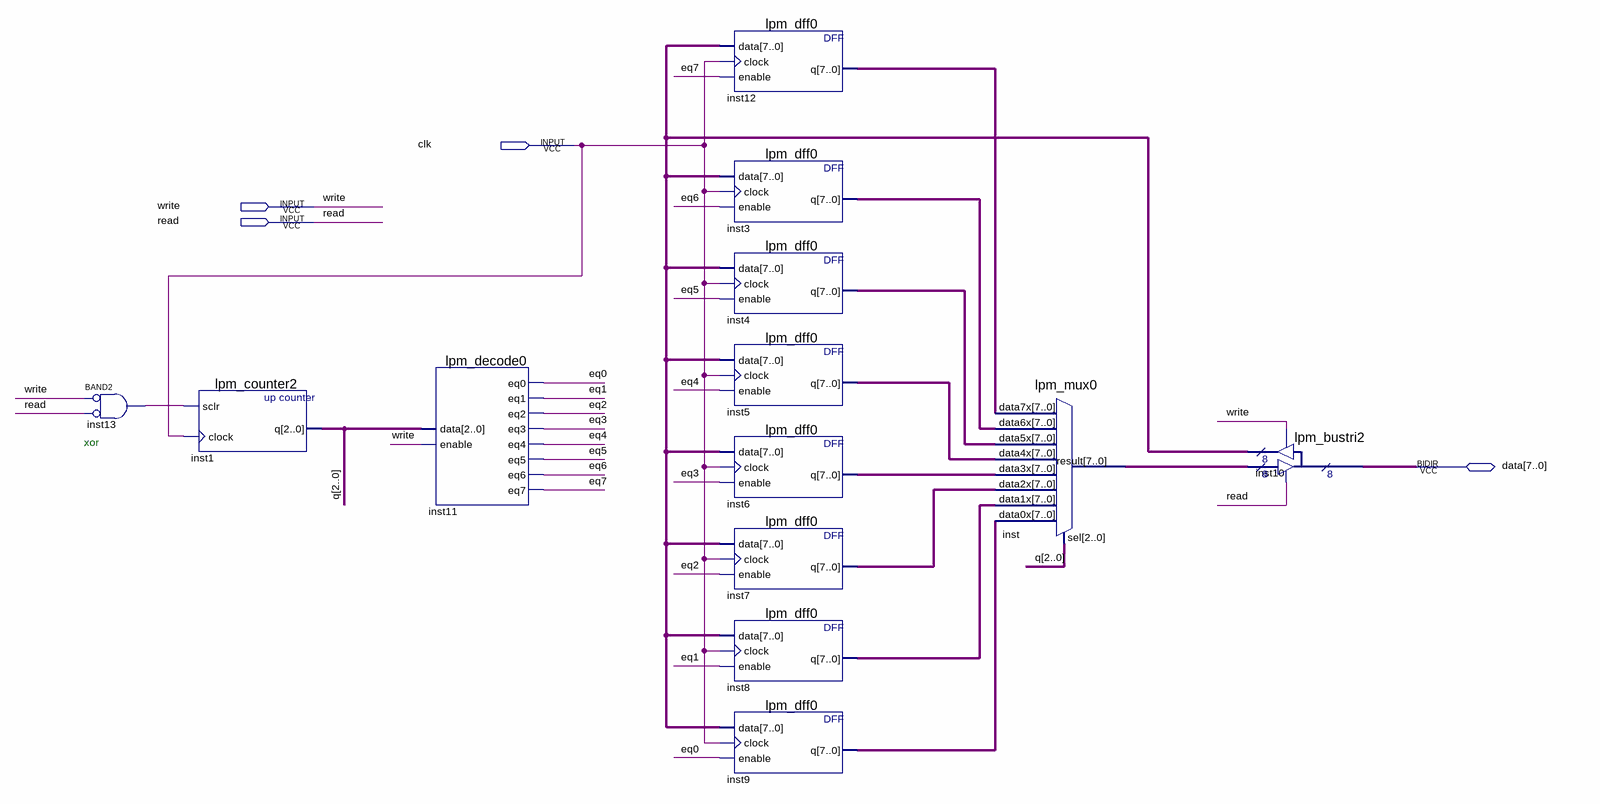
[diagram p0: schematic sheet]
// Quartus schematic Buffer.bdf as structural Verilog: 13 symbols, 4 pins
module Buffer (
  input  clk,
  input  write,
  input  read,
  inout  [7:0] data
);

  wire eq0, eq1, eq2, eq3, eq4, eq5, eq6, eq7, inst13_out;
  wire [2:0] q;
  wire [7:0] inst3_q, inst4_q, inst5_q, inst6_q, inst7_q, inst8_q, inst9_q, inst10_result, inst12_q,
       inst_result;

  and inst13 (inst13_out, ~write, ~read);  // BAND2
  lpm_counter2 inst1 (.sclr(inst13_out), .clock(clk), .q(q));
  lpm_decode0 inst11 (
    .data(q), .enable(write), .eq0(eq0), .eq1(eq1), .eq2(eq2), .eq3(eq3), .eq4(eq4), .eq5(eq5), .eq6(eq6),
    .eq7(eq7));
  lpm_dff0 inst12 (.data(inst10_result), .clock(clk), .enable(eq7), .q(inst12_q));
  lpm_dff0 inst3 (.data(inst10_result), .clock(clk), .enable(eq6), .q(inst3_q));
  lpm_dff0 inst4 (.data(inst10_result), .clock(clk), .enable(eq5), .q(inst4_q));
  lpm_dff0 inst5 (.data(inst10_result), .clock(clk), .enable(eq4), .q(inst5_q));
  lpm_dff0 inst6 (.data(inst10_result), .clock(clk), .enable(eq3), .q(inst6_q));
  lpm_dff0 inst7 (.data(inst10_result), .clock(clk), .enable(eq2), .q(inst7_q));
  lpm_dff0 inst8 (.data(inst10_result), .clock(clk), .enable(eq1), .q(inst8_q));
  lpm_dff0 inst9 (.data(inst10_result), .clock(clk), .enable(eq0), .q(inst9_q));
  lpm_mux0 inst (
    .data7x(inst12_q), .data6x(inst3_q), .data5x(inst4_q), .data4x(inst5_q), .data3x(inst6_q),
    .data2x(inst7_q), .data1x(inst8_q), .data0x(inst9_q), .sel(q), .result(inst_result));
  lpm_bustri2 inst10 (.enabledt(read), .data(inst_result), .enabletr(write), .result(inst10_result), .tridata(data));

  // Notes on the sheet:
  //   xor
endmodule
